# EAGLE design Reader1 (EAGLE 9.5.0)
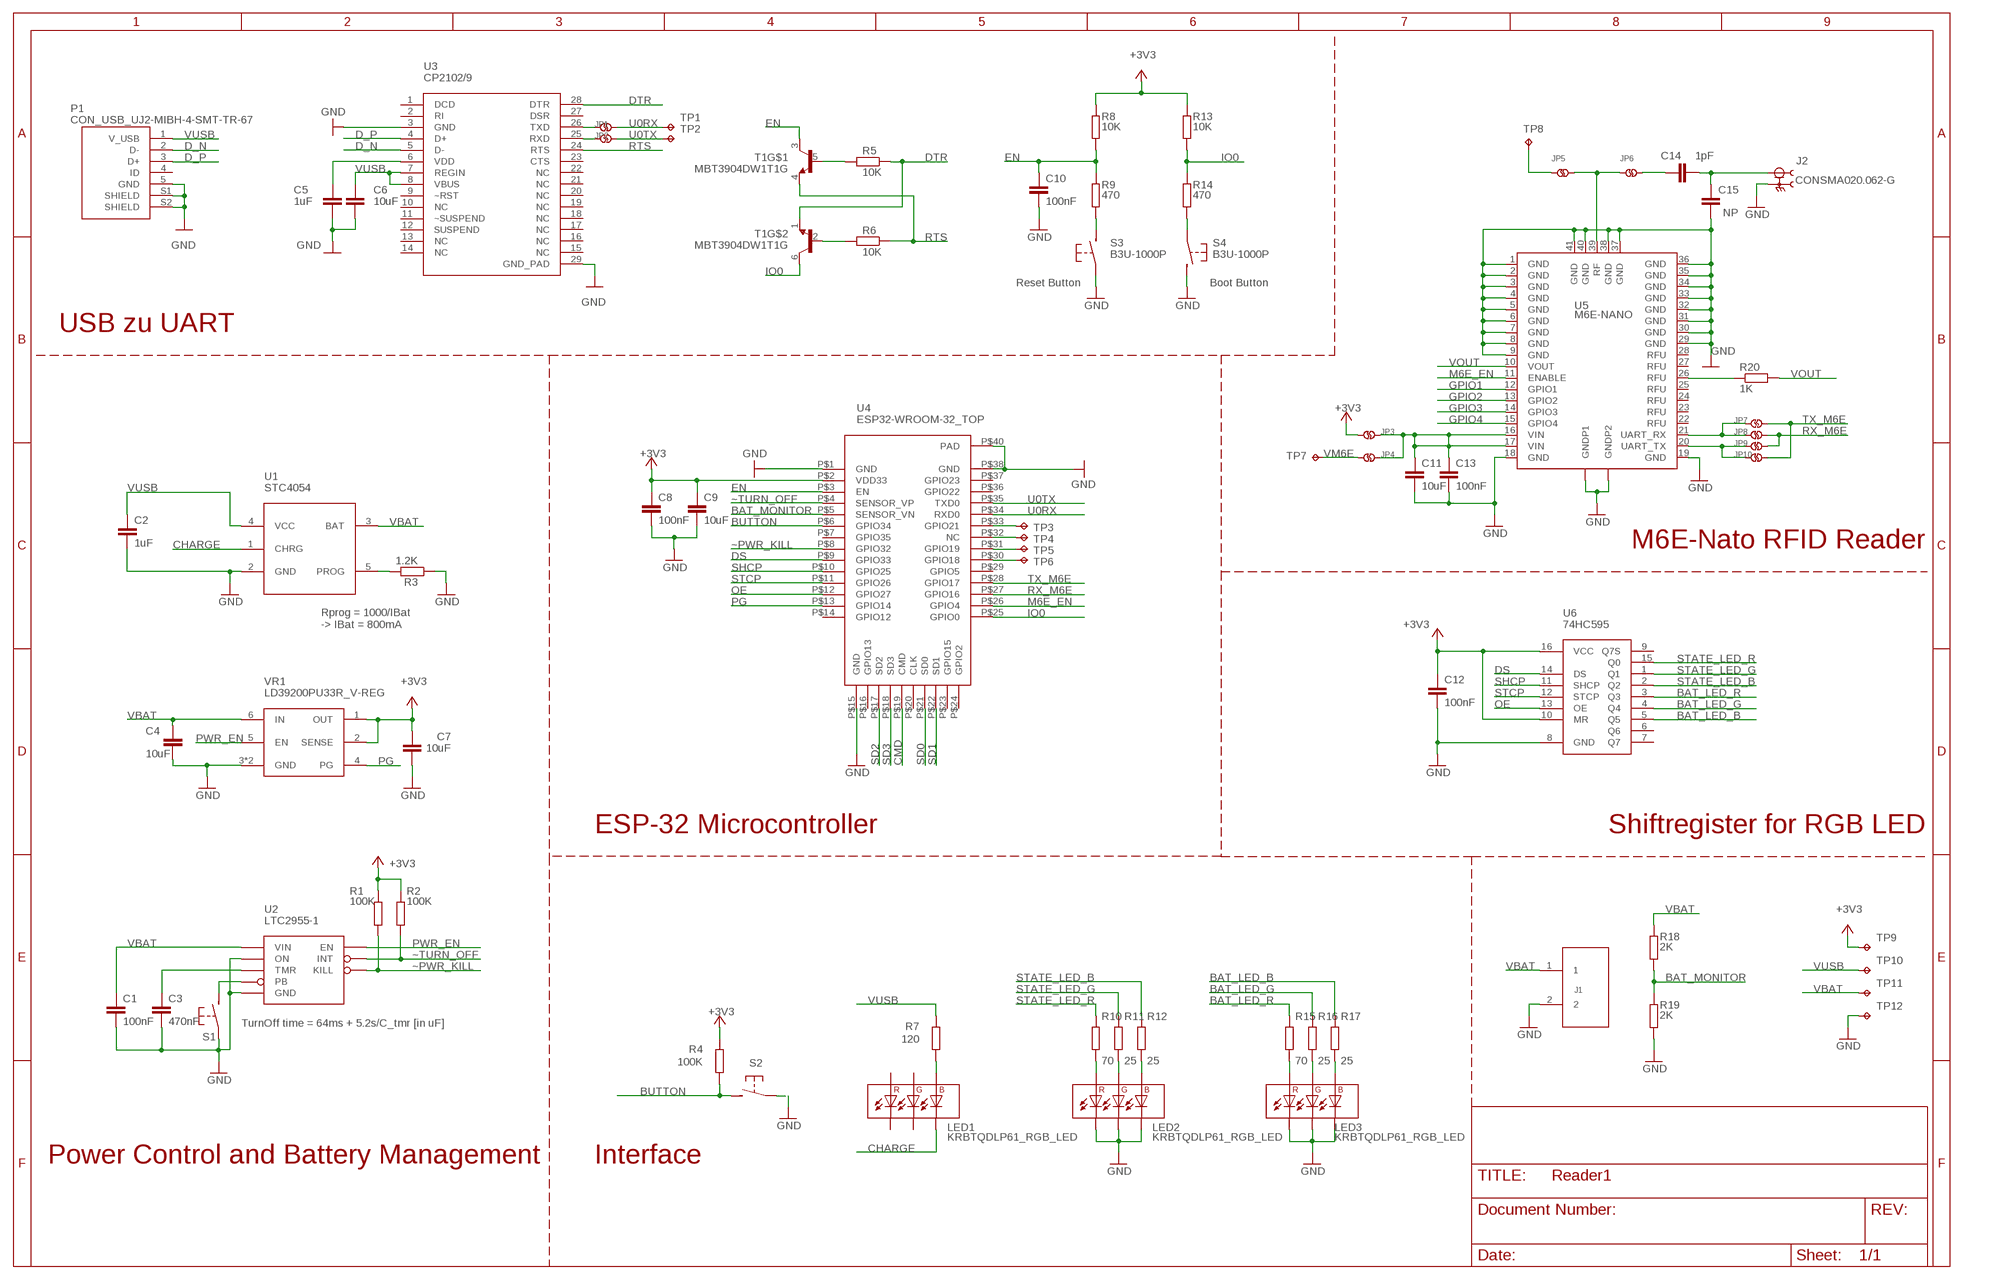
[diagram p0: schematic, sheet 1]

## Parts
C1  100nF  CAP_0603  [0603]
C2  1uF  CAP_0603  [0603]
C3  470nF  CAP_0603  [0603]
C4  10uF  CAP_0603  [0603]
C5  1uF  CAP_0603  [0603]
C6  10uF  CAP_0603  [0603]
C7  10uF  CAP_0603  [0603]
C8  100nF  CAP_0603  [0603]
C9  10uF  CAP_0603  [0603]
C10  100nF  CAP_0603  [0603]
C11  10uF  CAP_0603  [0603]
C12  100nF  CAP_0603  [0603]
C13  100nF  CAP_0603  [0603]
C14  1pF  CAP_0603  [0603]
C15  NP  CAP_0603  [0603]
J1  CON_2  [CON_2]
J2  CONSMA020.062-G  [LINX_CONSMA020.062-G]
JP1  SOLDER_JUMPER  [SOLDER_JUMPER]
JP2  SOLDER_JUMPER  [SOLDER_JUMPER]
JP3  SOLDER_JUMPER  [SOLDER_JUMPER]
JP4  SOLDER_JUMPER  [SOLDER_JUMPER]
JP5  SOLDER_JUMPER  [SOLDER_JUMPER]
JP6  SOLDER_JUMPER  [SOLDER_JUMPER]
JP7  SOLDER_JUMPER  [SOLDER_JUMPER]
JP8  SOLDER_JUMPER  [SOLDER_JUMPER]
JP9  SOLDER_JUMPER  [SOLDER_JUMPER]
JP10  SOLDER_JUMPER  [SOLDER_JUMPER]
LED1  KRBTQDLP61_RGB_LED  [KRBTQDLP61_RGB_LED]
LED2  KRBTQDLP61_RGB_LED  [KRBTQDLP61_RGB_LED]
LED3  KRBTQDLP61_RGB_LED  [KRBTQDLP61_RGB_LED]
P1  CON_USB_UJ2-MIBH-4-SMT-TR-67  [CON_USB_UJ2-MIBH-4-SMT-TR-67]
R1  100K  RES_0603  [0603]
R2  100K  RES_0603  [0603]
R3  1.2K  RES_0603  [0603]
R4  100K  RES_0603  [0603]
R5  10K  RES_0603  [0603]
R6  10K  RES_0603  [0603]
R7  120  RES_0603  [0603]
R8  10K  RES_0603  [0603]
R9  470  RES_0603  [0603]
R10  70  RES_0603  [0603]
R11  25  RES_0603  [0603]
R12  25  RES_0603  [0603]
R13  10K  RES_0603  [0603]
R14  470  RES_0603  [0603]
R15  70  RES_0603  [0603]
R16  25  RES_0603  [0603]
R17  25  RES_0603  [0603]
R18  2K  RES_0603  [0603]
R19  2K  RES_0603  [0603]
R20  1K  RES_0603  [0603]
S1  EG5358CT-ND_PB  [EG5358CT-ND_PB]
S2  EG5358CT-ND_PB  [EG5358CT-ND_PB]
S3  B3U-1000P  BUTTON_B3U-1000P  [B3U-1000P]
S4  B3U-1000P  BUTTON_B3U-1000P  [B3U-1000P]
T1  MBT3904DW1T1G  [SOT23-6]
TP1  TP  [TEST_PAD]
TP2  TP  [TEST_PAD]
TP3  TP  [TEST_PAD]
TP4  TP  [TEST_PAD]
TP5  TP  [TEST_PAD]
TP6  TP  [TEST_PAD]
TP7  TP  [TEST_PAD]
TP8  TP  [TEST_PAD]
TP9  TP  [TEST_PAD]
TP10  TP  [TEST_PAD]
TP11  TP  [TEST_PAD]
TP12  TP  [TEST_PAD]
U1  STC4054  STC4054_BAT_CHARGER  [TSOT23-5L]
U2  LTC2955-1  LTC2955-1_ON/OFF_CTLR  [SOT23-8]
U3  CP2102/9  [QFN-28]
U4  ESP32-WROOM-32_TOP  [ESP32-WROOM-32_TOP]
U5  M6E-NANO  [M6E-NANO]
U6  74HC595  74HC595_SHIFTREGISTER  [SOIC-16]
VR1  LD39200PU33R_V-REG  [DFN-6]

## Nets
+3V3: C7.2 C8.1 C9.1 C12.1 JP3.P$1 R1.1 R2.1 R4.2 R8.2 R13.2 TP9.TP U4.P$2(VDD33) U6.10(MR) U6.16(VCC) VR1.1(OUT) VR1.2(SENSE)
BAT_LED_B: R17.2 U6.5(Q5)
BAT_LED_G: R16.2 U6.4(Q4)
BAT_LED_R: R15.2 U6.3(Q3)
BAT_MONITOR: R18.2 R19.1 U4.P$5(SENSOR_VN)
BUTTON: R4.1 S2.2(S) U4.P$6(GPIO34)
CHARGE: LED1.P$4(BC) U1.1(CHRG)
CMD: U4.P$19(CMD)
D_N: P1.2(D-) U3.5(D-)
D_P: P1.3(D+) U3.4(D+)
DS: U4.P$9(GPIO33) U6.14(DS)
DTR: R5.1 T1.1(E) U3.28(DTR)
EN: C10.1 R8.1 R9.2 T1.3(C) U4.P$3(EN)
GND: C1.2 C2.2 C3.2 C4.2 C5.2 C6.2 C7.1 C8.2 C9.2 C10.2 C11.2 C12.2 C13.2 C15.1 J1.2 J2.S1 J2.S2 J2.S3 J2.S4 LED2.P$3(GC) LED2.P$4(BC) LED2.P$6(RC) LED3.P$3(GC) LED3.P$4(BC) LED3.P$6(RC) P1.5(GND) P1.S1(SHIELD) P1.S2(SHIELD) R3.1 R19.2 S1.1(P) S1.S1(P) S1.S2(P) S2.1(P) S2.S1(P) S2.S2(P) S3.P$1(P) S4.P$2(S) TP12.TP U1.2(GND) U2.1(ON) U2.4(GND) U3.3(GND) U3.29(GND_PAD) U4.P$1(GND) U4.P$15(GND) U4.P$38(GND) U4.P$40(PAD) U5.1(GND) U5.2(GND) U5.3(GND) U5.4(GND) U5.5(GND) U5.6(GND) U5.7(GND) U5.8(GND) U5.9(GND) U5.18(GND) U5.19(GND) U5.29(GND) U5.30(GND) U5.31(GND) U5.32(GND) U5.33(GND) U5.34(GND) U5.35(GND) U5.36(GND) U5.37(GND) U5.38(GND) U5.40(GND) U5.41(GND) U5.GND_PAD1(GNDP1) U5.GND_PAD2(GNDP2) U6.8(GND) VR1.3(GND) VR1.7(GND)
GPIO1: U5.12(GPIO1)
GPIO2: U5.13(GPIO2)
GPIO3: U5.14(GPIO3)
GPIO4: U5.15(GPIO4)
IO0: R13.1 R14.2 T1.6(C) U4.P$25(GPIO0)
M6E_EN: U4.P$26(GPIO4) U5.11(ENABLE)
N$1: R20.1 U5.26(RFU)
N$2: JP5.P$2 JP6.P$1 U5.39(RF)
N$3: C14.1 JP6.P$2
N$4: C14.2 C15.2 J2.1
N$5: JP5.P$1 TP8.TP
N$6: R5.2 T1.5(B)
N$7: R6.2 T1.2(B)
N$8: C5.1 U3.6(VDD)
N$9: LED3.P$5(RA) R15.1
N$10: R9.1 S3.P$2(S)
N$11: R14.1 S4.P$1(P)
N$13: C11.1 C13.1 JP3.P$2 JP4.P$2 U5.16(VIN) U5.17(VIN)
N$14: LED2.P$5(RA) R10.1
N$15: LED1.P$2(BA) R7.1
N$16: LED2.P$1(GA) R11.1
N$17: LED2.P$2(BA) R12.1
N$18: LED3.P$1(GA) R16.1
N$19: R3.2 U1.5(PROG)
N$20: JP1.P$1 U3.26(TXD)
N$21: LED3.P$2(BA) R17.1
N$22: JP2.P$1 U3.25(RXD)
N$23: S1.2(S) U2.5(PB)
N$24: TP5.TP U4.P$31(GPIO19)
N$25: C3.1 U2.3(TMR)
N$26: TP6.TP U4.P$30(GPIO18)
N$28: TP3.TP U4.P$33(GPIO21)
N$30: TP4.TP U4.P$32(NC)
OE: U4.P$12(GPIO27) U6.13(OE)
PG: U4.P$13(GPIO14) VR1.4(PG)
PWR_EN: U2.7(EN) VR1.5(EN)
RTS: R6.1 T1.4(E) U3.24(RTS)
RX_M6E: JP8.P$2 JP9.P$2 U4.P$27(GPIO16)
RXI: JP7.P$1 JP8.P$1 U5.21(UART_RX)
SD0: U4.P$21(SD0)
SD1: U4.P$22(SD1)
SD2: U4.P$17(SD2)
SD3: U4.P$18(SD3)
SHCP: U4.P$10(GPIO25) U6.11(SHCP)
STATE_LED_B: R12.2 U6.2(Q2)
STATE_LED_G: R11.2 U6.1(Q1)
STATE_LED_R: R10.2 U6.15(Q0)
STCP: U4.P$11(GPIO26) U6.12(STCP)
TX_M6E: JP7.P$2 JP10.P$2 U4.P$28(GPIO17)
TXO: JP9.P$1 JP10.P$1 U5.20(UART_TX)
U0RX: JP1.P$2 TP1.TP U4.P$34(RXD0)
U0TX: JP2.P$2 TP2.TP U4.P$35(TXD0)
VBAT: C1.1 C4.1 J1.1 R18.1 TP11.TP U1.3(BAT) U2.6(VIN) VR1.6(IN)
VM6E: JP4.P$1 TP7.TP
VOUT: R20.2 U5.10(VOUT)
VUSB: C2.1 C6.1 P1.1(V_USB) R7.2 TP10.TP U1.4(VCC) U3.7(REGIN) U3.8(VBUS)
~PWR_KILL: R1.2 U2.2(KILL) U4.P$8(GPIO32)
~TURN_OFF: R2.2 U2.8(INT) U4.P$4(SENSOR_VP)
Unconnected: LED1.P$1(GA) LED1.P$3(GC) LED1.P$5(RA) LED1.P$6(RC) P1.4(ID) U3.1(DCD) U3.2(RI) U3.9(~RST) U3.10(NC) U3.11(~SUSPEND) U3.12(SUSPEND) U3.13(NC) U3.14(NC) U3.15(NC) U3.16(NC) U3.17(NC) U3.18(NC) U3.19(NC) U3.20(NC) U3.21(NC) U3.22(NC) U3.23(CTS) U3.27(DSR) U4.P$7(GPIO35) U4.P$14(GPIO12) U4.P$16(GPIO13) U4.P$20(CLK) U4.P$23(GPIO15) U4.P$24(GPIO2) U4.P$29(GPIO5) U4.P$36(GPIO22) U4.P$37(GPIO23) U5.22(RFU) U5.23(RFU) U5.24(RFU) U5.25(RFU) U5.27(RFU) U5.28(RFU) U6.6(Q6) U6.7(Q7) U6.9(Q7S)

## Notes on the sheet
- Reset Button | Boot Button
- USB zu UART
- M6E-Nato RFID Reader
- Rprog = 1000/IBat 
  -> IBat = 800mA
- ESP-32 Microcontroller | Shiftregister for RGB LED
- TurnOff time = 64ms + 5.2s/C_tmr [in uF]
- Power Control and Battery Management | Interface

## Library data of the parts
C1-C15 = ZHAW_BA:CAP_0603: Cap, 0603, Keramik, X7R, +-10%
J1 = ZHAW_BA:CON_2: 2 Pin Solder Pad
J2 = ZHAW_BA:CONSMA020.062-G: SMA FEMALE EDGE MOUNT FOR 0.062" BOARD, GOLD DigiKey: Pt.Nr: 343-CONSMA020.062-G-ND https://www.digikey.ch/product-detail/de/linx-technologies-inc/CONSMA020-062-G/343-CONSMA020-062-G-ND/11482822; DESCRIPTION: SMA Edge Mount Female Receptacle 0.062 PCB Mount, Gold; DIGI-KEY_PART_NUMBER: 343-CONSMA020.062-G-ND; MF: Linx Technologies; MP: CONSMA020.062-G; PACKAGE: None; PURCHASE-URL: https://pricing.snapeda.com/search/part/CONSMA020.062-G/?ref=eda
JP1-JP10 = ZHAW_BA:SOLDER_JUMPER
LED1-LED3 = ZHAW_BA:KRBTQDLP61_RGB_LED: RGB LED, 2,1V Rot, 3,2V Grün, 2,9V Blau @ 20mA KRBT QDLP61.3A-5B5C-CF DigiKey: Pt.Nr: 475-3482-1-ND https://www.digikey.ch/product-detail/de/osram-opto-semiconductors-inc/KRBT-QDLP61-3A-5B5C-CF/475-3482-1-ND/7907970
P1 = ZHAW_BA:CON_USB_UJ2-MIBH-4-SMT-TR-67: Micro B USB Buchse, 90° PCB Mount UJ2-MIBH-4-SMT-TR-67 DigiKey: Pt.Nr: 102-4970-1-ND https://www.digikey.ch/product-detail/de/cui-devices/UJ2-MIBH-4-SMT-TR-67/102-4970-1-ND/9564435
R1-R20 = ZHAW_BA:RES_0603: Resistor, 0603, 0.1 W, +-1%
S1 S2 = ZHAW_BA:EG5358CT-ND_PB: Push Button, 90° PCB Mount, TL3360CF185Q DigiKey: Pt.Nr: EG5358CT-ND https://www.digikey.ch/product-detail/de/e-switch/TL3360CF185Q/EG5358CT-ND/5816203
S3 S4 = ZHAW_BA:BUTTON_B3U-1000P: SMD Button, 3 x 2.5 x 1.6 mm, 12V Distrelec: Pt.Nr: SW1020CT-ND https://www.digikey.ch/product-detail/de/omron-electronics-inc-emc-div/B3U-1000P/SW1020CT-ND/1534357 DigiKey: Pt.Nr: 135-59-010 https://www.distrelec.ch/de/subminiatur-tastschalter-b3u-schliesser-5n-5mm-omron-electronic-components-b3u-1000p/p/13559010?track=true&no-cache=true&marketingPopup=false
T1 = ZHAW_BA:MBT3904DW1T1G: Beschreibung Zweifacher NPN Transistor, 200mA, 40V DigiKey: Pt.Nr: MBT3904DW1T1GOSCT-ND https://www.digikey.ch/product-detail/de/on-semiconductor/MBT3904DW1T1G/MBT3904DW1T1GOSCT-ND/918012
TP1-TP12 = ZHAW_BA:TP
U1 = ZHAW_BA:STC4054_BAT_CHARGER: STC4054GR IC BATT CHG LI-ION 1CEL TSOT23-5, 800mA DigiKey: Pt.Nr: 497-5809-1-ND https://www.digikey.ch/product-detail/de/stmicroelectronics/STC4054GR/497-5809-1-ND/1506465
U2 = ZHAW_BA:LTC2955-1_ON/OFF_CTLR: On/OFF Controller, PUSHBUTT TSOT23-8 DigiKey: Pt.Nr: LTC2955CTS8-1#TRMPBFCT-ND https://www.digikey.ch/products/de?keywords=LTC2955CTS8-1%23TRMPBFCT-ND
U3 = ZHAW_BA:CP2102/9: Schnittstellen - Controller, USB-TO-UART BRIDGE 28VQFN DigiKey: Pt.Nr: 336-1160-1-ND https://www.digikey.ch/products/de/integrated-circuits-ics/interface-controllers/753?k=CP2102&k=&pkeyword=CP2102&sv=0&pv7=2&sf=0&FV=-8%7C753&quantity=&ColumnSort=0&page=1&stock=1&pageSize=25
U4 = ZHAW_BA:ESP32-WROOM-32_TOP: ESP32 Mikrokontroller Distrelec: Pt.Nr: 301-29-219 https://www.distrelec.ch/de/esp32-wlan-bt-ble-mcu-modul-adafruit-3320/p/30129219?track=true&no-cache=true&marketingPopup=false DigiKey: Pt.Nr: 1528-1801-ND https://www.digikey.ch/product-detail/de/adafruit-industries-llc/3320/1528-1801-ND/6560941
U5 = ZHAW_BA:M6E-NANO: UHF RFID READER Modul 859-930MHZ, Thingmagic, M6E-Nano Distrelec: Pt.Nr: Distrelec Bestellnummer LINK DigiKey: Pt.Nr: 1523-1009-2-ND https://www.digikey.ch/product-detail/de/thingmagic-a-jadak-brand/M6E-NANO/1523-1009-2-ND/5251712
U6 = ZHAW_BA:74HC595_SHIFTREGISTER: Shiftregister 74HC595D-Q100,118, 8Bit DigiKey: Pt.Nr: 1727-1011-1-ND https://www.digikey.ch/product-detail/de/nexperia-usa-inc/74HC595D-Q100-118/1727-1011-1-ND/3749018
VR1 = ZHAW_BA:LD39200PU33R_V-REG: Spannungsregler, LD39200PU33R, 3.3V, 2A, 0.15mV DigiKey: Pt.Nr: 497-15229-1-ND https://www.digikey.ch/product-detail/de/stmicroelectronics/LD39200PU33R/497-15229-1-ND/5131765

## Board
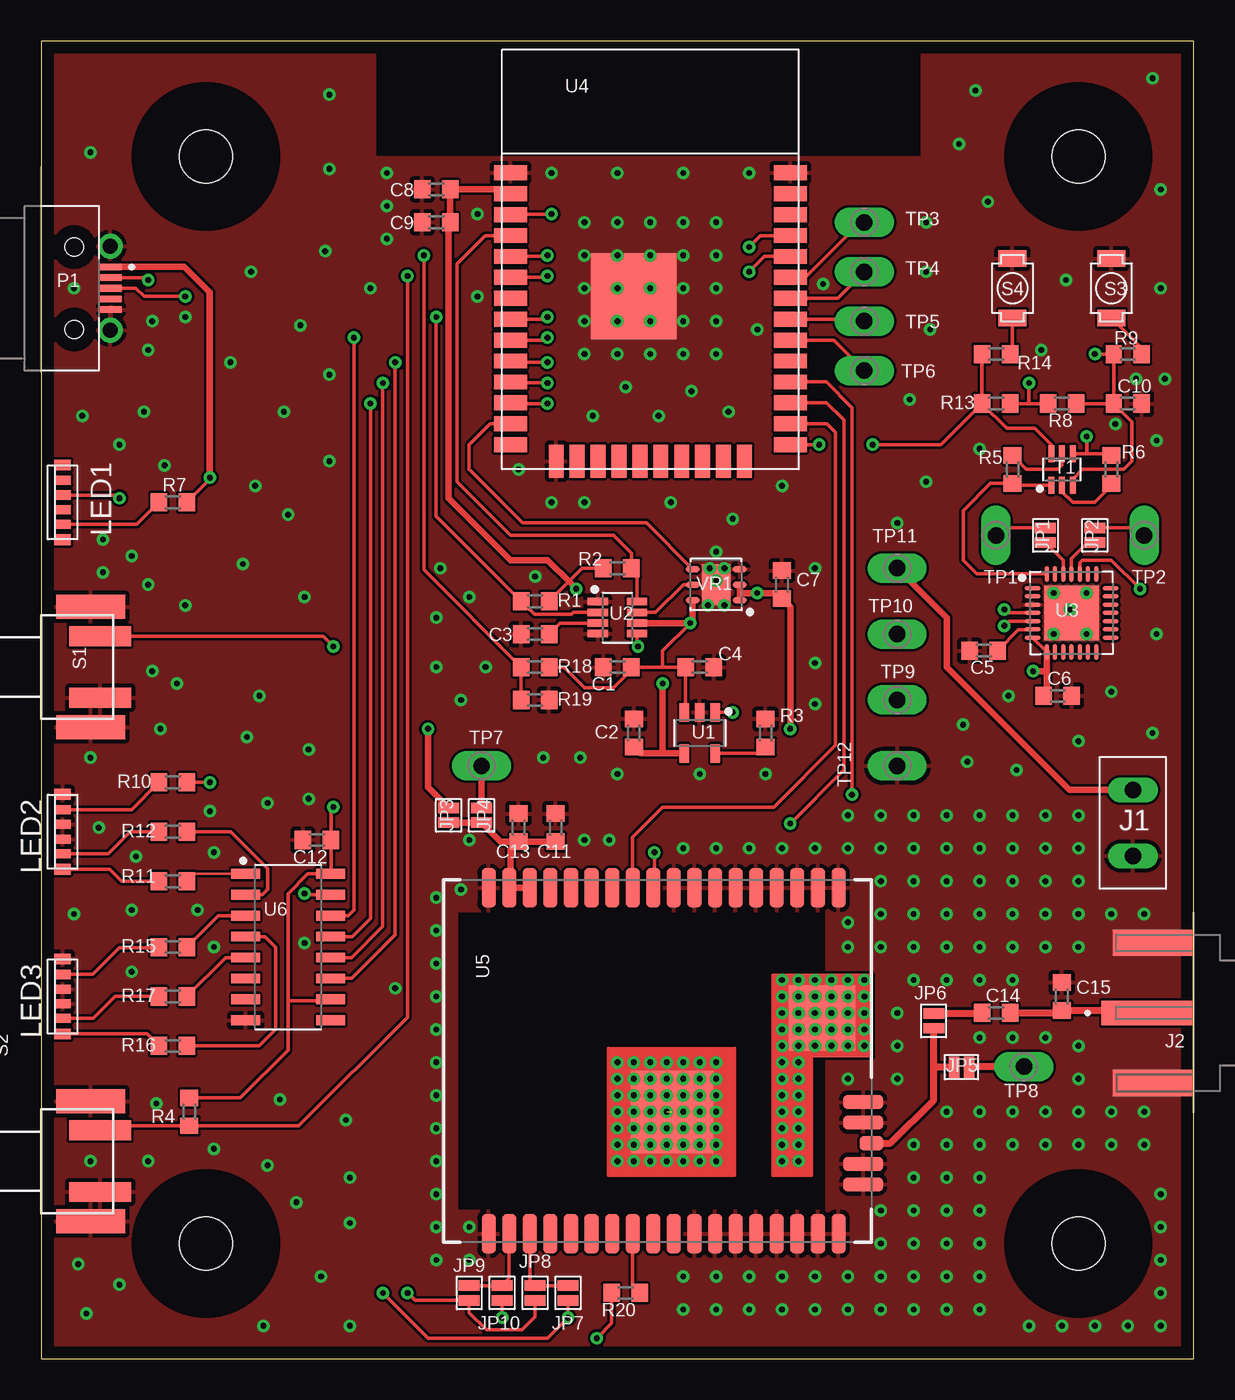
[diagram p1: board, top side]
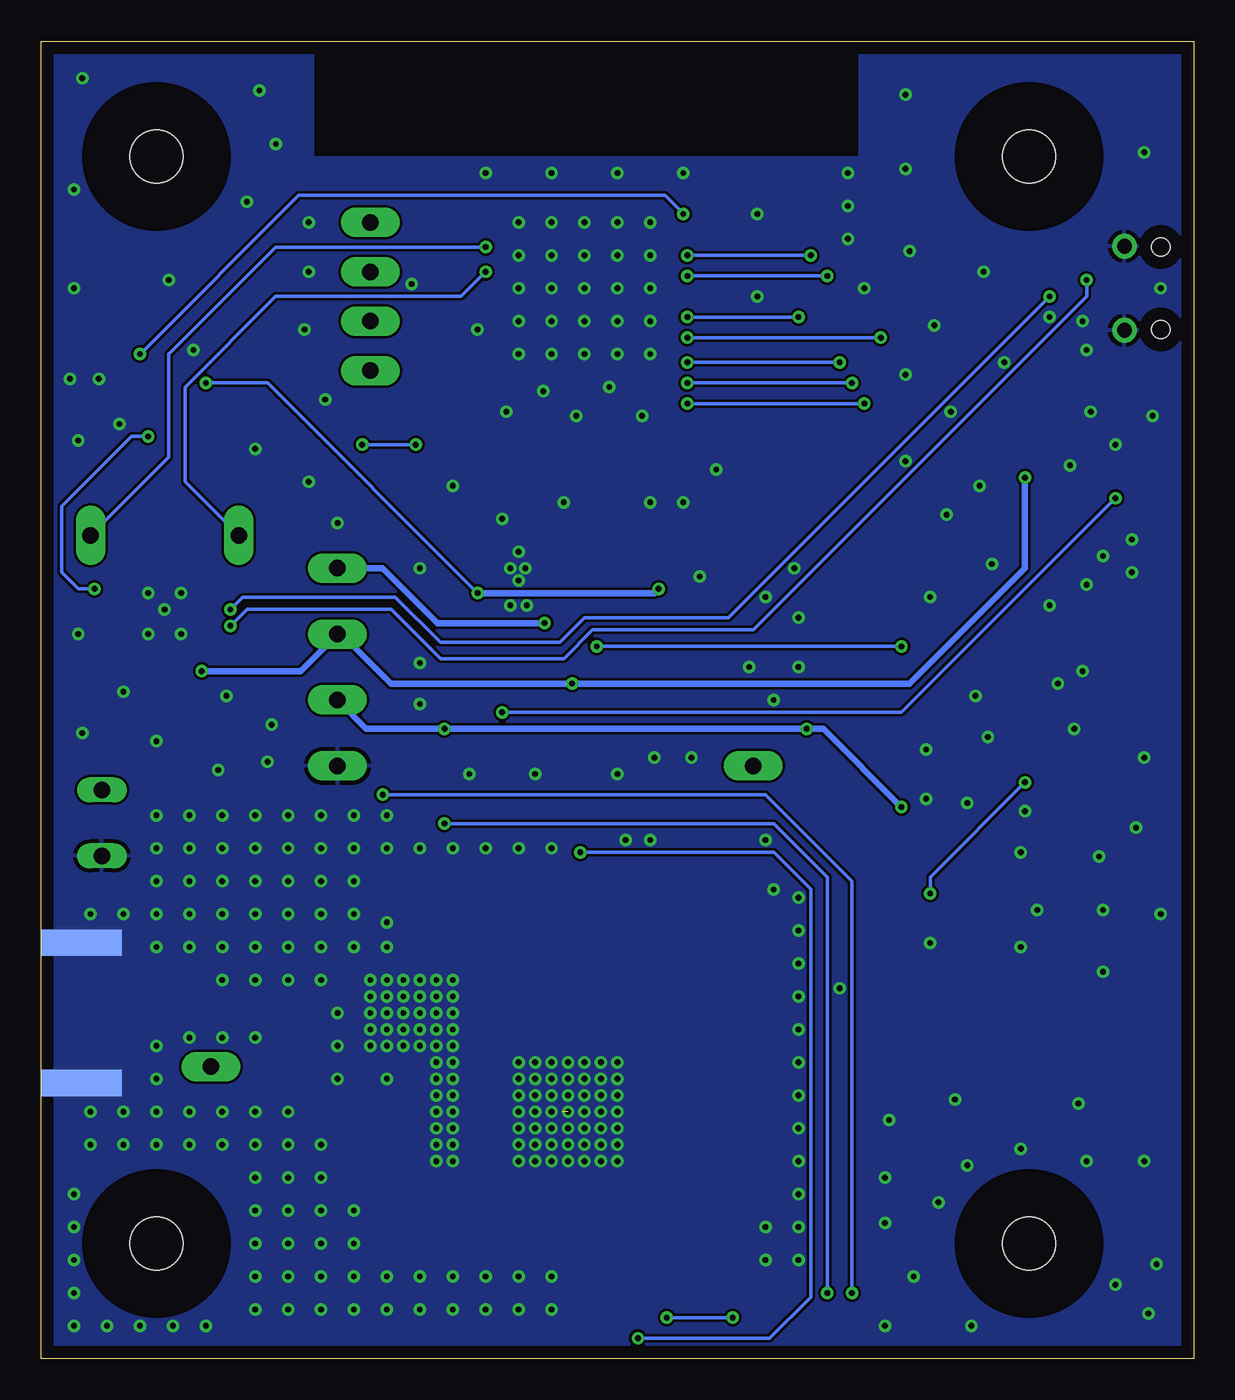
[diagram p2: board, bottom side, seen from below]

Size 70 x 80 mm. Coordinates in mm from the lower left corner, seen from the top.
Outline: 0,0 70,0 70,80 0,80 0,0
Copper layers (1*16): Top 0.035mm / dielectric 1.5mm / Bottom 0.035mm
Design rules "default *": minimum track width 6mil, minimum drill 0.35mm, track to track 6mil, track to pad 6mil, pad to pad 5mil, via to via 6mil, smd to smd 5mil, copper to edge 30mil, drill to drill 6mil, minimum pad ring 10mil, minimum via ring 8mil, stop-mask expansion 4mil, vias tented up to drill 14mil, thermal gap 10mil
Holes 3.2 mm at 10,7 63,7 10,73 63,73
tRestrict: area 5.5,2.5 to 14.5,11.5; area 5.5,68.5 to 14.5,77.5; area 58.5,68.5 to 67.5,77.5; area 58.5,2.5 to 67.5,11.5
bRestrict: area 5.5,2.5 to 14.5,11.5; area 58.5,2.5 to 67.5,11.5; area 58.5,68.5 to 67.5,77.5; area 5.5,68.5 to 14.5,77.5

### Footprints (pad centres in the part's own frame; a part is rotated, then mirrored left to right if it is on the bottom)
0603 = smd 1 x 1.1: 1 -0.85,0; 2 0.85,0
CON_2 = drill 1 long: 1 -2,0; 2 2,0
LINX_CONSMA020.062-G = smd 1.5 x 5.6: 1 0,2.8 | smd 1.6 x 4.9: S1 -4.26,2.45; S2 4.26,2.45 | smd 1.6 x 4.9 bottom: S3 -4.26,2.45; S4 4.26,2.45
SOLDER_JUMPER = smd 0.635 x 1.27: P$1 -0.45,0; P$2 0.45,0
KRBTQDLP61_RGB_LED = smd 0.65 x 1: P$1 -2.275,0; P$6 2.275,0 | smd 0.55 x 1: P$2 -1.335,0; P$3 -0.445,0; P$4 0.445,0; P$5 1.335,0
CON_USB_UJ2-MIBH-4-SMT-TR-67 = smd 1.3 x 0.4: 1 4.25,1.3; 2 4.25,0.65; 3 4.25,0; 4 4.25,-0.65; 5 4.25,-1.3 | drill 0.9 pad 1.5: S1 4.2,2.55; S2 4.2,-2.55 | hole 1.1: 2,2.5; 2,-2.5
EG5358CT-ND_PB = smd 1.2 x 3.76: 1 -1.87,-3.58; 2 1.87,-3.58 | smd 1.46 x 4.19: S1 -3.65,-3; S2 3.65,-3
B3U-1000P = smd 1 x 1.7: P$1 -1.8,0; P$2 1.8,0
SOT23-6 = smd 1.02 x 0.36: 1 -0.955,0.65; 2 -0.955,0; 3 -0.955,-0.65; 4 0.955,-0.65; 5 0.955,0; 6 0.955,0.65
TEST_PAD = drill 1 pad 1.8 long: TP 0,0
TSOT23-5L = smd 1.119 x 0.589: 1 -1.246,0.95; 2 -1.246,0; 3 -1.246,-0.95; 4 1.246,-0.95; 5 1.246,0.95
SOT23-8 = smd 1.237 x 0.459: 1 -1.187,0.975; 2 -1.187,0.325; 3 -1.187,-0.325; 4 -1.187,-0.975; 5 1.187,-0.975; 6 1.187,-0.325; 7 1.187,0.325; 8 1.187,0.975
QFN-28 = smd 0.969 x 0.264: 1 -2.371,1.5; 2 -2.371,1; 3 -2.371,0.5; 4 -2.371,0; 5 -2.371,-0.5; 6 -2.371,-1; 7 -2.371,-1.5; 15 2.371,-1.5; 16 2.371,-1; 17 2.371,-0.5; 18 2.371,0; 19 2.371,0.5; 20 2.371,1; 21 2.371,1.5 | smd 0.264 x 0.969: 8 -1.5,-2.371; 9 -1,-2.371; 10 -0.5,-2.371; 11 0,-2.371; 12 0.5,-2.371; 13 1,-2.371; 14 1.5,-2.371; 22 1.5,2.371; 23 1,2.371; 24 0.5,2.371; 25 0,2.371; 26 -0.5,2.371; 27 -1,2.371; 28 -1.5,2.371 | smd 3.3 x 3.3: 29 0,0
ESP32-WROOM-32_TOP = smd 2 x 0.9: P$1 0.5,18.01; P$2 0.5,16.74; P$3 0.5,15.47; P$4 0.5,14.2; P$5 0.5,12.93; P$6 0.5,11.66; P$7 0.5,10.39; P$8 0.5,9.12; P$9 0.5,7.85; P$10 0.5,6.58; P$11 0.5,5.31; P$12 0.5,4.04; P$13 0.5,2.77; P$14 0.5,1.5; P$25 17.5,1.5; P$26 17.5,2.77; P$27 17.5,4.04; P$28 17.5,5.31; P$29 17.5,6.58; P$30 17.5,7.85; P$31 17.5,9.12; P$32 17.5,10.39; P$33 17.5,11.66; P$34 17.5,12.93; P$35 17.5,14.2; P$36 17.5,15.47; P$37 17.5,16.74; P$38 17.5,18.01 | smd 0.9 x 2: P$15 3.285,0.5; P$16 4.555,0.5; P$17 5.825,0.5; P$18 7.095,0.5; P$19 8.365,0.5; P$20 9.635,0.5; P$21 10.905,0.5; P$22 12.175,0.5; P$23 13.445,0.5; P$24 14.715,0.5 | smd 5.2 x 5.2: P$40 8,10.51
M6E-NANO = smd 2.4 x 0.85: 1 -0.34,22.43; 2 -0.34,21.18; 3 -0.34,19.93; 4 -0.34,18.68; 5 -0.34,17.43; 6 -0.34,16.18; 7 -0.34,14.93; 8 -0.34,13.68; 9 -0.34,12.43; 10 -0.34,11.18; 11 -0.34,9.93; 12 -0.34,8.68; 13 -0.34,7.43; 14 -0.34,6.18; 15 -0.34,4.93; 16 -0.34,3.68; 17 -0.34,2.43; 18 -0.34,1.18; 19 20.66,1.18; 20 20.66,2.43; 21 20.66,3.68; 22 20.66,4.93; 23 20.66,6.18; 24 20.66,7.43; 25 20.66,8.68; 26 20.66,9.93; 27 20.66,11.18; 28 20.66,12.43; 29 20.66,13.68; 30 20.66,14.93; 31 20.66,16.18; 32 20.66,17.43; 33 20.66,18.68; 34 20.66,19.93; 35 20.66,21.18; 36 20.66,22.43 | smd 0.85 x 2.4: 37 17.66,23.93; 38 16.41,23.93; 40 13.91,23.93; 41 12.66,23.93 | smd 0.85 x 1.4: 39 15.16,24.43 | smd 5 x 5: GND_PAD1 13.26,12.33 | smd 4 x 4: GND_PAD2 7.56,21.43
SOIC-16 = smd 1.746 x 0.592: 1 -2.585,4.445; 2 -2.585,3.175; 3 -2.585,1.905; 4 -2.585,0.635; 5 -2.585,-0.635; 6 -2.585,-1.905; 7 -2.585,-3.175; 8 -2.585,-4.445; 9 2.585,-4.445; 10 2.585,-3.175; 11 2.585,-1.905; 12 2.585,-0.635; 13 2.585,0.635; 14 2.585,1.905; 15 2.585,3.175; 16 2.585,4.445
DFN-6 = smd 0.86 x 0.397: 1 -1.435,0.95; 2 -1.435,0; 3 -1.435,-0.95; 4 1.435,-0.95; 5 1.435,0; 6 1.435,0.95 | smd 1.75 x 2.5: 7 0,0

### Placement (x,y rotation side)
C1  35,42 180 top
C2  36,38 90 top
C3  30,44 180 top
C4  40,42 0 top
C5  57.25,43 180 top
C6  61.75,40.25 0 top
C7  45,47 270 top
C8  24,71 180 top
C9  24,69 180 top
C10  66,58 0 top
C11  31.25,32.25 90 top
C12  16.75,31.5 180 top
C13  29,32.25 90 top
C14  58,21 0 top
C15  62,22 270 top
J1  66.31,32.54 270 top
J2  70,21 90 top
JP1  61,50 90 top
JP2  64,50 90 top
JP3  24.75,33 270 top
JP4  26.75,33 270 top
JP5  55.9,17.71 180 top
JP6  54.21,20.52 90 top
JP7  32,4 270 top
JP8  30,4 270 top
JP9  26,4 270 top
JP10  28,4 270 top
LED1  1.3,52 90 top
LED2  1.3,32 90 top
LED3  1.3,22 90 top
P1  0,65 0 top
R1  30,46 180 top
R2  35,48 0 top
R3  44,38 270 top
R4  9,15 90 top
R5  59,54 90 top
R6  65,54 270 top
R7  8,52 0 top
R8  62,58 180 top
R9  66,61 180 top
R10  8,35 0 top
R11  8,29 0 top
R12  8,32 0 top
R13  58,58 0 top
R14  58,61 180 top
R15  8,25 0 top
R16  8,19 0 top
R17  8,22 0 top
R18  30,42 180 top
R19  30,40 0 top
R20  35.5,4 180 top
S1  0,42 90 top
S2  0,12 90 top
S3  65,65 270 top
S4  59,65 90 top
T1  62,54 90 top
TP1  58,50 0 top
TP2  67,50 0 top
TP3  50,69 90 top
TP4  50,66 90 top
TP5  50,63 90 top
TP6  50,60 90 top
TP7  26.75,36 270 top
TP8  59.69,17.74 90 top
TP9  52,40 90 top
TP10  52,44 90 top
TP11  52,48 90 top
TP12  52,36 90 top
U1  40,38 270 top
U2  35,45 0 top
U3  62.58,45.29 0 top
U4  28,54 0 top
U5  26,28.25 270 top
U6  15,25 0 top
VR1  41,47 180 top

### Tracks (layer width: path | path; a pad name or v marks a point on that pad's centre or on a via)
+3V3  (via drill 0.35)
  Top 0.2: 15,21.75 15,18.75 12.1,15.85 R4.2 | 15,21.75 15,28.25 16.2,29.45 U6.16 17.6,29.46 C12.1 17.6,33.35 v17.75,33.5 | U6.10 17.51,21.75 15,21.75 | U4.P$2 28.24,71 | R13.2 60,58 | 60,58 R8.2 | 60,58 v60,59.25 | R2.1 32.85,48 32.05,47.2 R1.1 | 42.44,46.99 VR1.2 | 42.44,46.49 42.44,46.5 | v43.49,46.49 v43.5,46.48 | 24.75,68.9 C9.1
  Top 0.4: C9.1 C8.1 28.24,71 | VR1.2 42.44,46.5 VR1.1 | v32.5,46.75 32.05,47.2 30.75,48.5 28.5,48.5 24.75,52.25 24.75,68.9 | v43.49,46.49 42.44,46.49 | v43.5,46.48 44.66,46.48 C7.2 45.5,45.65 v45.5,38.25 | JP3.P$1 23.5,34.7 v23.5,38.25
  Bottom 0.2: v32.5,46.75 32.76,46.49 | v43.49,46.49 56.25,59.25 v60,59.25
  Bottom 0.4: v43.49,46.49 32.76,46.49 | v17.75,33.5 22.5,38.25 v23.5,38.25 v45.5,38.25 50.25,38.25 TP9.TP
BAT_LED_B
  Top 0.2: R17.2 11.21,24.36 U6.5
BAT_LED_G
  Top 0.2: R16.2 13.25,19 14.25,20 14.25,25 13.62,25.64 U6.4
BAT_LED_R
  Top 0.2: R15.2 10.76,26.91 U6.3
BAT_MONITOR  (via drill 0.35)
  Top 0.2: R19.1 R18.2 23.25,47.9 v23.25,67 | v30.75,67 30.68,66.93 U4.P$5
  Bottom 0.2: v23.25,67 v30.75,67
BUTTON  (via drill 0.35)
  Top 0.152: S2.2 3.86,14.15
  Top 0.2: 3.86,14.15 R4.1 15.65,14.15 22.25,20.75 v22.25,65.75 | v30.75,65.75 30.66,65.66 U4.P$6
  Bottom 0.2: v22.25,65.75 v30.75,65.75
CHARGE  (via drill 0.35)
  Top 0.2: v42,39.25 U1.1 | LED1.P$4 4.55,52.45 v4.75,52.25
  Bottom 0.2: v4.75,52.25 17.75,39.25 v42,39.25
D_N  (via drill 0.35)
  Top 0.2: P1.2 6.35,65.65 v6.5,65.5 | v58.5,44.5 58.79,44.79 U3.5
  Bottom 0.2: v6.5,65.5 6.5,64.5 26.75,44.25 36.5,44.25 38.25,42.5 45.75,42.5 48.75,45.5 57.5,45.5 v58.5,44.5
D_P  (via drill 0.35)
  Top 0.2: P1.3 5.75,65 6.25,64.5 v8.75,64.5 | v58.5,45.5 58.71,45.29 U3.4
  Bottom 0.2: v58.5,45.5 57.75,46.25 48.5,46.25 45.75,43.5 38.5,43.5 37,45 28.25,45 v8.75,64.5
DS  (via drill 0.35)
  Top 0.2: U6.14 18.66,26.91 19,27.25 v19,62 | v30.75,62 30.6,61.85 U4.P$9
  Bottom 0.2: v19,62 v30.75,62
DTR
  Top 0.2: T1.1 59.1,53.05 R5.1 57.65,53.15 56,51.5 56,48.5 56.84,47.66 U3.28
EN  (via drill 0.35)
  Top 0.2: C10.1 R9.2 v64,61 | C10.1 R8.1 | T1.3 62.65,53.4 63.25,54 65.75,54 66.25,54.5 66.25,56.9 C10.1 | v31,69.5 28.53,69.5 U4.P$3
  Bottom 0.2: v31,69.5 31,69.53 32.12,70.65 54.35,70.65 v64,61
GND  (via drill 0.35)  (1 unrouted)
  other vias: 35,18 36,18 37,18 38,18 39,18 40,18 41,18 41,17 40,17 39,17 38,17 37,17 36,17 35,17 35,16 35,15 35,14 35,13 35,12 36,12 37,12 38,12 39,12 40,12 41,12 41,13 41,14 41,15 41,16 40,16 40,15 40,14 40,13 39,13 38,13 37,13 36,13 36,14 36,15 36,16 37,16 38,16 39,16 39,15 39,14 38,14 38,15 37,15 37,14 45,12 45,13 46,12 46,13 46,14 46,15 46,16 46,17 46,18 46,19 47,19 48,19 49,19 50,19 50,20 50,21 50,22 50,23 49,23 48,23 47,23 46,23 45,23 45,22 45,21 45,20 45,19 45,18 45,17 45,16 45,15 45,14 46,20 47,20 48,20 46,22 46,21 47,21 48,21 48,22 47,22 49,22 49,21 49,20 39,31 41,31 43,31 45,31 47,31 49,31 51,31 53,31 55,31 57,31 59,31 61,31 63,31 51,29 51,27 51,25 49,25 53,25 53,27 53,29 55,29 55,27 55,25 53,23 55,23 57,23 59,23 59,25 57,25 57,27 57,29 59,29 59,27 61,29 63,29 61,27 63,27 65,27 67,27 61,25 63,25 67,15 63,15 65,15 61,15 59,15 57,15 55,15 53,13 55,13 57,13 59,13 61,13 63,13 65,13 67,13 53,11 53,9 53,7 53,5 53,3 49,3 51,3 51,5 49,5 47,5 47,3 45,5 45,3 43,3 43,5 41,5 39,5 39,3 41,3 55,3 57,3 57,5 57,7 57,9 57,11 55,11 55,9 55,7 55,5 51,9 51,7 63,17 63,19 52,21 52,19 52,17 49,17 61,19.5 59,19.5 57,19.5 49,26.5 34.5,31.5 33,31.5 26,31.5 25.5,28.5 24,28 24,26 24,24 24,22 24,20 24,18 24,16 24,14 24,12 24,10 24,8 24,6 26,6 26,8 60,2 62,2 64,2 66,2 68,2 68,4 68,6 68,8 68,10 63,33 61,33 59,33 57,33 55,33 53,33 51,33 49,33 44,35.5 40,35.5 35,35.5 30.5,36.5 24,42 27,42 24,45 30,47.5 65,40.5 63,37.5 61.5,44 63.5,44 63.5,46.5 61.5,46.5 62.5,45.5 40.6,48 41.5,48 41,47.25 40.5,45.75 41.5,45.75 41,49 26.5,69.5 6.75,63 6.25,57.5 7.5,54.25 5.5,48.75 8.75,45.75 8.25,41 13.25,40.25 25.5,40 32.75,36.5 16,46.25 15,51.25 15.75,62.75 17.25,67.25 17.5,72.25 17.5,76.75 3,73.25 33.5,57.25 37.5,57.25 41.75,57.5 41,61 33,61 33,63 33,65 33,67 35,67 37,67 39,67 41,67 41,65 41,63 39,61 37,61 35,61 35,63 35,65 37,65 37,63 39,63 39,65 33,69 35,69 37,69 39,69 41,69 43,72 39,72 35,72 31,72 21,72 21,70 21,68 31,52 33,52 29,54 45,53 42,51 47,48 26,46.25 24.25,48 17.5,54.5 14.75,57.5 11.5,60.5 8.75,63.25 12.75,66 53.75,69 53.75,66 54,62.5 52.75,58.25 53.75,53.25 52,50.75 57,55.25 65.25,56.75 67.75,55.75 68.25,59.5 66.5,59.5 60.75,61.25 62.25,65.5 68,65 57.5,70.25 55.75,73.75 56.75,77 67.5,77.75 68,71 67.75,44 67.5,38 58.75,40.25 56,38.5 56.25,36.25 59.25,35.75 47,39.75 47,42.25 13.75,33.75 16.25,34 5.5,27.25 2,27 3,36.5 7.25,38.25 6.75,41.75 3.75,47.75 6.5,47 3.75,49.75 4.75,55.5 2.5,57.25 6.5,61.25 2,65 17.5,59.75 47.5,65.25 14.5,15.75 7,15.5 6.5,12 3,12 2.25,5.75 4.75,4.5 2.75,2.75 13.5,2 18.75,2 17,5 18.75,8.25 15.5,9.5 18.75,11 13.75,11.75 18.5,14.5 10.5,12.75 16,25.25 9.5,27.25 10.5,25 12.5,37.75 13,53 5.75,30.5 3.5,32.25 10.25,33.25 10.5,30.75 16.25,37 38.25,52 20,65 26.5,64.5 43.5,62.5 35.5,59 39.5,58.75 12.25,48.25 5.5,23.5 21.5,22.5
  pour Top: -2,82 76,82 76,-7 -2,-7
  pour Bottom: -5,84 -5,-3 72,-3 72,84
IO0  (via drill 0.35)
  Top 0.2: T1.6 61.35,55.5 60.35,56.5 58.65,56.5 R13.1 | R14.2 R13.1 | U4.P$25 v47.25,55.5 | v50.5,55.5 54.65,55.5 R13.1
  Bottom 0.2: v47.25,55.5 v50.5,55.5
M6E_EN
  Top 0.2: U5.11 35.93,31.68 37.75,33.5 44.5,33.5 48.25,37.25 48.25,56.25 47.73,56.77 U4.P$26
N$1
  Top 0.2: U5.26 35.93,4.42 R20.1
N$2
  Top 0.44: U5.39 51.59,13.09 54.21,15.71 54.21,17.75 | 54.21,17.75 JP6.P$1 | JP5.P$2 54.25,17.71 54.21,17.75
N$3
  Top 0.44: JP6.P$2 57.12,20.97 C14.1
N$4
  Top 0.44: C14.2 61.85,21 C15.2 67.05,21.15 J2.1
N$5
  Top 0.44: TP8.TP 56.38,17.74 JP5.P$1
N$6
  Top 0.2: T1.5 62,54.25 61.75,54 59.85,54 R5.2
N$7
  Top 0.2: R6.2 65,53 64,52 62.65,52 62,52.65 T1.2
N$8
  Top 0.2: U3.6 60.17,44.25 59.35,44.25 C5.1
N$9
  Top 0.152: 7.1,24.95 R15.1
  Top 0.2: 7.1,24.95 4.75,24.95 3.13,23.34 LED3.P$5
N$10
  Top 0.2: S3.P$2 66.85,61.35 R9.1
N$11
  Top 0.2: S4.P$1 59,61.15 R14.1
N$13
  Top 0.4: JP3.P$2 JP4.P$2 27.9,31.4 C13.1 | C13.1 C11.1 | U5.17 28.5,28.59 | 28.5,28.59 U5.16 | C13.1 28.5,30.9 28.5,28.59
N$14
  Top 0.2: LED2.P$5 5.49,33.34 R10.1
N$15
  Top 0.2: LED1.P$2 5.82,50.66 R7.1
N$16
  Top 0.2: R11.1 4.9,29 4.17,29.73 LED2.P$1
N$17
  Top 0.2: R12.1 5.4,32 4.07,30.66 LED2.P$2
N$18
  Top 0.2: LED3.P$1 6.42,19.73 R16.1
N$19
  Top 0.2: U1.5 43.6,36.75 R3.2
N$20
  Top 0.2: JP1.P$1 62.08,48.47 U3.26
N$21
  Top 0.2: LED3.P$2 3.17,20.66 4.5,22 R17.1
N$22
  Top 0.2: JP2.P$1 63.55,49.55 62.58,48.58 U3.25
N$23  (via drill 0.35)
  Top 0.2: S1.2 17.13,43.87 v17.75,43.25 | v36.25,43.25 36.19,43.31 U2.5
  Bottom 0.2: v36.25,43.25 v17.75,43.25
N$24
  Top 0.2: TP5.TP 49.88,63.12 U4.P$31
N$25
  Top 0.2: C3.1 31.52,44.67 U2.3
N$26
  Top 0.2: TP6.TP 48.15,61.85 U4.P$30
N$28
  Top 0.2: U4.P$33 46.41,65.66 49.75,69 TP3.TP
N$30
  Top 0.2: TP4.TP 48.39,64.39 U4.P$32
OE  (via drill 0.35)
  Top 0.2: U6.13 18.89,25.64 20,26.75 v20,58 | v30.75,58 28.54,58 U4.P$12
  Bottom 0.2: v20,58 v30.75,58
PG
  Top 0.2: VR1.4 36.77,50.75 29.25,50.75 26,54 26,55.5 27.27,56.77 U4.P$13
PWR_EN
  Top 0.2: U2.7 37.33,45.33 39,47 VR1.5
RTS  (via drill 0.35)
  Top 0.2: R6.1 64.89,54.95 63.5,54.95 | 63.5,54.95 T1.4 | U3.24 63.08,48.33 63.25,48.5 65,48.5 v66.75,46.75 | 63.5,54.95 v63.5,56
  Bottom 0.2: v63.5,56 64.5,56 68.75,51.75 68.75,47.75 67.75,46.75 v66.75,46.75
RX_M6E  (via drill 0.35)
  Top 0.2: JP8.P$2 30,2.55 29.2,1.75 27.05,1.75 26,2.8 JP9.P$2 22.7,3.55 v22.25,4 | v45.5,32.5 48.75,35.75 48.75,57 47.71,58.04 U4.P$27
  Bottom 0.2: v22.25,4 22.25,29.25 25.5,32.5 v45.5,32.5
RXI
  Top 0.2: JP7.P$1 JP8.P$1 29.68,4.77 U5.21
SHCP  (via drill 0.35)
  Top 0.2: U6.11 18.84,23.09 21.5,25.75 v21.5,60.5 | v30.75,60.5 28.58,60.5 U4.P$10
  Bottom 0.2: v21.5,60.5 v30.75,60.5
STATE_LED_B
  Top 0.2: U6.2 13.43,28.18 13.75,28.5 13.75,29.75 11.5,32 R12.2
STATE_LED_G
  Top 0.152: R11.2 9.29,29.45 U6.1
STATE_LED_R  (via drill 0.35)
  Top 0.2: U6.15 16.07,28.18 v16,28.25 | v10.25,35 R10.2
  Bottom 0.2: v16,28.25 16,29.25 v10.25,35
STCP  (via drill 0.35)
  Top 0.2: U6.12 18.86,24.36 20.75,26.25 v20.75,59.25 | v30.75,59.25 28.56,59.25 U4.P$11
  Bottom 0.2: v20.75,59.25 v30.75,59.25
TX_M6E  (via drill 0.35)
  Top 0.2: JP10.P$2 v28,2.5 | JP7.P$2 v32,2.5 30.75,1.25 23.5,1.25 v20.75,4 | v49.25,34.25 49.25,57.75 47.69,59.31 U4.P$28
  Bottom 0.2: v28,2.5 v32,2.5 | v20.75,4 20.75,29 26,34.25 v49.25,34.25
TXO
  Top 0.2: JP9.P$1 JP10.P$1 28.43,4.88 U5.20
U0RX  (via drill 0.35)
  Top 0.2: JP1.P$2 58.45,50.45 TP1.TP | U4.P$34 43.93,66.93 v43,66
  Bottom 0.2: TP1.TP 61.25,53.25 61.25,59 55.75,64.5 44.5,64.5 v43,66
U0TX  (via drill 0.35)
  Top 0.2: JP2.P$2 66.55,50.45 TP2.TP | v43,67.5 43.7,68.2 U4.P$35
  Bottom 0.2: TP2.TP 62.25,54.75 62.25,61 | 62.25,61 62.25,61.03 | 62.25,61 55.75,67.5 v43,67.5
VBAT  (via drill 0.35)
  Top 0.2: 37.75,42 C4.1 39.15,39.35 U1.3 | 37.75,42 C1.1 35.85,41.85 34.75,40.75 33,40.75 31.75,42 R18.1 | v39.42,44.67 37.75,43 37.75,42
  Top 0.4: U2.6 v39.42,44.67 39.56,44.81 VR1.6 | J1.1 62.46,34.54 55,42 55,45 TP11.TP
  Bottom 0.4: TP11.TP 49.25,48 45.92,44.67 v39.42,44.67
VM6E
  Top 0.4: JP4.P$1 TP7.TP
VOUT  (via drill 0.35)
  Top 0.2: v37.25,30.75 37.25,28.66 U5.10 | R20.2 34.65,2.15 v33.75,1.25
  Bottom 0.2: v33.75,1.25 25.75,1.25 23.25,3.75 23.25,28.5 25.5,30.75 v37.25,30.75
VUSB  (via drill 0.35)
  Top 0.2: C2.1 36.4,36.75 | U3.7 U3.8 | R7.2 10.25,53.4 v10.25,53.5 | 61.08,40.43 C6.1
  Top 0.4: P1.1 8.7,66.3 10.25,64.75 v10.25,53.5 | 36.4,36.75 37.75,36.75 | 37.75,36.75 U1.4 | 37.75,36.75 v37.75,41 | U3.8 61.08,41.75 | 61.08,41.75 61.08,40.43 | 61.08,41.75 v60.25,41.75
  Bottom 0.2: 51.75,44 TP10.TP
  Bottom 0.4: v10.25,53.5 10.25,48 17.25,41 v37.75,41 48.75,41 51.75,44 | v60.25,41.75 54.25,41.75 TP10.TP
~PWR_KILL  (via drill 0.35)
  Top 0.2: U2.2 32.33,45.33 32.2,45.2 29.95,45.2 R1.2 24,51.15 v24,63.25 | v30.75,63.25 30.62,63.12 U4.P$8
  Bottom 0.2: v24,63.25 v30.75,63.25
~TURN_OFF
  Top 0.2: U2.8 36.19,47.66 R2.2 35.85,48.9 34.75,50 28.5,50 25.25,53.25 25.25,66.5 26.95,68.2 U4.P$4

### Text on the board
tStop: TOP
bStop: BOT | Reader v1 / BA MagicTrick / ZHAW SoE, 2021